# Altium schematic sheet Magnetometer.SchDoc
size A
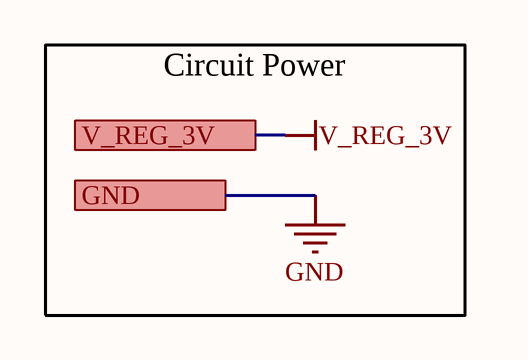
[diagram p0: Magnetometer.SchDoc]

## Ports
GND, V_REG_3V

## Nets
GND: port GND
V_REG_3V: port V_REG_3V

## Notes on the sheet
- Circuit Power